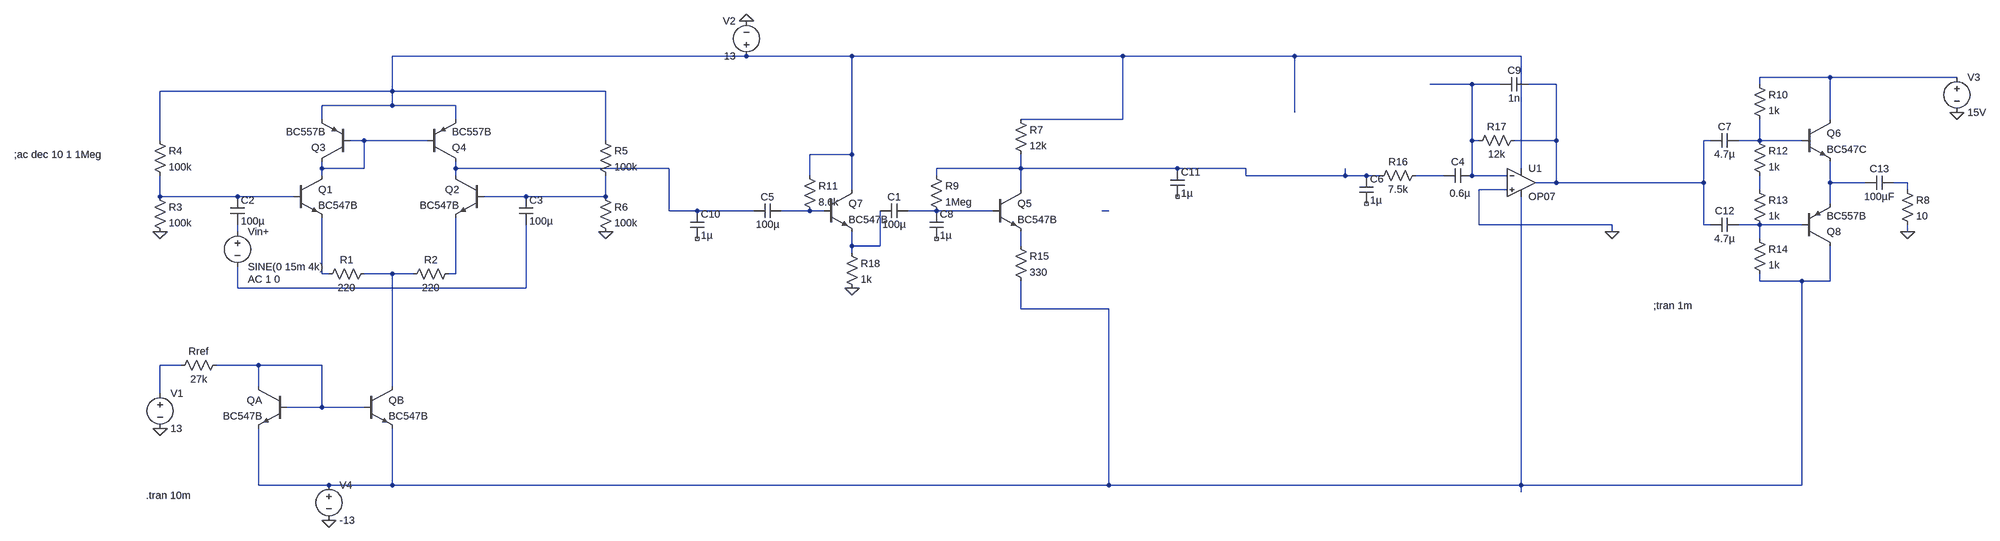
[diagram p0: schematic Complete_ckt.asc]
Complete_ckt.asc, the LTspice schematic file:
Version 4
SHEET 1 4536 1044
WIRE 1072 -192 160 -192
WIRE 1312 -192 1072 -192
WIRE 1936 -192 1312 -192
WIRE 2928 -192 1936 -192
WIRE 3472 -192 2928 -192
WIRE 4176 -144 4016 -144
WIRE 4464 -144 4176 -144
WIRE 3360 -128 3264 -128
WIRE 3424 -128 3360 -128
WIRE 3552 -128 3488 -128
WIRE 4016 -128 4016 -144
WIRE 160 -112 160 -192
WIRE 160 -112 -368 -112
WIRE 752 -112 160 -112
WIRE 160 -80 160 -112
WIRE 160 -80 0 -80
WIRE 304 -80 160 -80
WIRE 2928 -64 2928 -192
WIRE 0 -48 0 -80
WIRE 304 -48 304 -80
WIRE 1936 -48 1936 -192
WIRE 1936 -48 1696 -48
WIRE 4176 -48 4176 -144
WIRE -368 0 -368 -112
WIRE 96 0 64 0
WIRE 240 0 96 0
WIRE 752 0 752 -112
WIRE 3360 0 3360 -128
WIRE 3376 0 3360 0
WIRE 3552 0 3552 -128
WIRE 3552 0 3456 0
WIRE 3904 0 3888 0
WIRE 4016 0 4016 -48
WIRE 4016 0 3968 0
WIRE 4112 0 4016 0
WIRE 1312 32 1312 -192
WIRE 1312 32 1216 32
WIRE 0 64 0 48
WIRE 96 64 96 0
WIRE 96 64 0 64
WIRE 304 64 304 48
WIRE 896 64 304 64
WIRE 1696 64 1696 32
WIRE 1696 64 1504 64
WIRE 2112 64 1696 64
WIRE 2784 64 2112 64
WIRE 3472 64 3472 -192
WIRE 0 80 0 64
WIRE 304 80 304 64
WIRE 1216 80 1216 32
WIRE 1504 80 1504 64
WIRE 2784 80 2784 64
WIRE 3072 80 3072 64
WIRE 3072 80 2784 80
WIRE 3120 80 3072 80
WIRE 3152 80 3120 80
WIRE 3296 80 3232 80
WIRE 3360 80 3360 0
WIRE 3440 80 3360 80
WIRE 3552 96 3552 0
WIRE 3552 96 3504 96
WIRE 3888 96 3888 0
WIRE 3888 96 3552 96
WIRE 4176 96 4176 48
WIRE 4256 96 4176 96
WIRE 4352 96 4320 96
WIRE 1312 112 1312 32
WIRE 1696 112 1696 64
WIRE 3440 112 3376 112
WIRE 4016 112 4016 80
WIRE 4352 112 4352 96
WIRE -368 128 -368 80
WIRE -192 128 -368 128
WIRE -64 128 -192 128
WIRE 464 128 368 128
WIRE 752 128 752 80
WIRE 752 128 464 128
WIRE 4176 144 4176 96
WIRE 896 160 896 64
WIRE 960 160 896 160
WIRE 1088 160 960 160
WIRE 1216 160 1152 160
WIRE 1248 160 1216 160
WIRE 1504 160 1440 160
WIRE 1632 160 1504 160
WIRE 1904 160 1888 160
WIRE 3376 192 3376 112
WIRE 3680 192 3376 192
WIRE 3888 192 3888 96
WIRE 3904 192 3888 192
WIRE 4016 192 3968 192
WIRE 4112 192 4016 192
WIRE -192 208 -192 192
WIRE 3680 208 3680 192
WIRE 4352 208 4352 192
WIRE 4016 224 4016 192
WIRE 1312 240 1312 208
WIRE 1376 240 1376 160
WIRE 1376 240 1312 240
WIRE 1696 240 1696 208
WIRE 1312 256 1312 240
WIRE 0 304 0 176
WIRE 16 304 0 304
WIRE 160 304 96 304
WIRE 208 304 160 304
WIRE 304 304 304 176
WIRE 304 304 288 304
WIRE 4016 320 4016 304
WIRE 4112 320 4016 320
WIRE 4176 320 4176 240
WIRE 4176 320 4112 320
WIRE -192 336 -192 288
WIRE 464 336 464 192
WIRE 464 336 -192 336
WIRE 1696 384 1696 320
WIRE 1904 384 1696 384
WIRE -320 512 -368 512
WIRE -144 512 -240 512
WIRE 0 512 -144 512
WIRE -144 560 -144 512
WIRE 160 560 160 304
WIRE -368 576 -368 512
WIRE 0 608 0 512
WIRE 0 608 -80 608
WIRE 96 608 0 608
WIRE -144 880 -144 656
WIRE 16 880 -144 880
WIRE 160 880 160 656
WIRE 160 880 16 880
WIRE 1904 880 1904 384
WIRE 1904 880 160 880
WIRE 3472 880 3472 128
WIRE 3472 880 1904 880
WIRE 4112 880 4112 320
WIRE 4112 880 3472 880
WIRE 3472 896 3472 880
FLAG -368 656 0
FLAG -368 208 0
FLAG 752 208 0
FLAG 3680 208 0
FLAG 16 960 0
FLAG 1072 -272 0
FLAG 1312 336 0
FLAG 4352 208 0
FLAG 4464 -64 0
SYMBOL npn 368 80 M0
SYMATTR InstName Q2
SYMATTR Value BC547B
SYMBOL npn -64 80 R0
SYMATTR InstName Q1
SYMATTR Value BC547B
SYMBOL res 112 288 R90
WINDOW 0 0 56 VBottom 2
WINDOW 3 32 56 VTop 2
SYMATTR InstName R1
SYMATTR Value 220
SYMBOL res 304 288 R90
WINDOW 0 0 56 VBottom 2
WINDOW 3 32 56 VTop 2
SYMATTR InstName R2
SYMATTR Value 220
SYMBOL npn 96 560 R0
SYMATTR InstName QB
SYMATTR Value BC547B
SYMBOL npn -80 560 M0
SYMATTR InstName QA
SYMATTR Value BC547B
SYMBOL res -224 496 R90
WINDOW 0 0 56 VBottom 2
WINDOW 3 32 56 VTop 2
SYMATTR InstName Rref
SYMATTR Value 27k
SYMBOL voltage -192 192 R0
WINDOW 123 24 124 Left 2
WINDOW 39 0 0 Left 0
SYMATTR Value2 AC 1 0
SYMATTR InstName Vin+
SYMATTR Value SINE(0 15m 4k)
SYMBOL voltage -368 560 R0
WINDOW 123 0 0 Left 0
WINDOW 39 0 0 Left 0
SYMATTR InstName V1
SYMATTR Value 13
SYMBOL cap -208 128 R0
SYMATTR InstName C2
SYMATTR Value 100µ
SYMBOL res -384 112 R0
SYMATTR InstName R3
SYMATTR Value 100k
SYMBOL res -384 -16 R0
SYMATTR InstName R4
SYMATTR Value 100k
SYMBOL res 736 -16 R0
SYMATTR InstName R5
SYMATTR Value 100k
SYMBOL res 736 112 R0
SYMATTR InstName R6
SYMATTR Value 100k
SYMBOL npn 1632 112 R0
SYMATTR InstName Q5
SYMATTR Value BC547B
SYMBOL res 1680 -64 R0
SYMATTR InstName R7
SYMATTR Value 12k
SYMBOL cap 1440 144 R90
WINDOW 0 0 32 VBottom 2
WINDOW 3 32 32 VTop 2
SYMATTR InstName C1
SYMATTR Value 100µ
SYMBOL cap 1152 144 R90
WINDOW 0 0 32 VBottom 2
WINDOW 3 32 32 VTop 2
SYMATTR InstName C5
SYMATTR Value 100µ
SYMBOL res 1680 224 R0
SYMATTR InstName R15
SYMATTR Value 330
SYMBOL res 1488 64 R0
SYMATTR InstName R9
SYMATTR Value 1Meg
SYMBOL cap 448 128 R0
SYMATTR InstName C3
SYMATTR Value 100µ
SYMBOL cap 3360 64 R90
WINDOW 0 0 32 VBottom 2
WINDOW 3 41 27 VTop 2
SYMATTR InstName C4
SYMATTR Value 0.6µ
SYMBOL res 3248 64 R90
WINDOW 0 0 56 VBottom 2
WINDOW 3 32 56 VTop 2
SYMATTR InstName R16
SYMATTR Value 7.5k
SYMBOL OpAmps\\OP07 3472 32 R0
SYMATTR InstName U1
SYMBOL res 3472 -16 R90
WINDOW 0 0 56 VBottom 2
WINDOW 3 32 56 VTop 2
SYMATTR InstName R17
SYMATTR Value 12k
SYMBOL voltage 16 864 R0
WINDOW 123 0 0 Left 0
WINDOW 39 0 0 Left 0
SYMATTR InstName V4
SYMATTR Value -13
SYMBOL voltage 1072 -176 R180
WINDOW 0 24 96 Left 2
WINDOW 3 24 16 Left 2
WINDOW 123 0 0 Left 0
WINDOW 39 0 0 Left 0
SYMATTR InstName V2
SYMATTR Value 13
SYMBOL pnp 64 48 R180
SYMATTR InstName Q3
SYMATTR Value BC557B
SYMBOL pnp 240 48 M180
SYMATTR InstName Q4
SYMATTR Value BC557B
SYMBOL npn 1248 112 R0
SYMATTR InstName Q7
SYMATTR Value BC547B
SYMBOL res 1200 64 R0
SYMATTR InstName R11
SYMATTR Value 8.6k
SYMBOL res 1296 240 R0
SYMATTR InstName R18
SYMATTR Value 1k
SYMBOL cap 1488 160 R0
SYMATTR InstName C8
SYMATTR Value 1µ
SYMBOL cap 944 160 R0
SYMATTR InstName C10
SYMATTR Value 1µ
SYMBOL cap 3488 -144 R90
WINDOW 0 0 32 VBottom 2
WINDOW 3 32 32 VTop 2
SYMATTR InstName C9
SYMATTR Value 1n
SYMBOL cap 2096 64 R0
SYMATTR InstName C11
SYMATTR Value 1µ
SYMBOL cap 3104 80 R0
SYMATTR InstName C6
SYMATTR Value 1µ
SYMBOL npn 4112 -48 R0
SYMATTR InstName Q6
SYMATTR Value BC547C
SYMBOL pnp 4112 240 M180
SYMATTR InstName Q8
SYMATTR Value BC557B
SYMBOL cap 3968 -16 R90
WINDOW 0 0 32 VBottom 2
WINDOW 3 32 32 VTop 2
SYMATTR InstName C7
SYMATTR Value 4.7µ
SYMBOL cap 3968 176 R90
WINDOW 0 0 32 VBottom 2
WINDOW 3 32 32 VTop 2
SYMATTR InstName C12
SYMATTR Value 4.7µ
SYMBOL res 4336 96 R0
SYMATTR InstName R8
SYMATTR Value 10
SYMBOL res 4000 -144 R0
SYMATTR InstName R10
SYMATTR Value 1k
SYMBOL res 4000 -16 R0
SYMATTR InstName R12
SYMATTR Value 1k
SYMBOL res 4000 96 R0
SYMATTR InstName R13
SYMATTR Value 1k
SYMBOL res 4000 208 R0
SYMATTR InstName R14
SYMATTR Value 1k
SYMBOL voltage 4464 -160 R0
WINDOW 123 0 0 Left 0
WINDOW 39 0 0 Left 0
SYMATTR InstName V3
SYMATTR Value 15V
SYMBOL cap 4320 80 R90
WINDOW 0 0 32 VBottom 2
WINDOW 3 32 32 VTop 2
SYMATTR InstName C13
SYMATTR Value 100µF
TEXT -400 904 Left 2 !.tran 10m
TEXT -760 32 Left 2 !;ac dec 10 1 1Meg
TEXT 3774 376 Left 2 !;tran 1m

The netlist it stands for:
* Complete_ckt.asc
Q2 N007 N014 N024 0 BC547B
Q1 N005 N013 N022 0 BC547B
R1 N023 N022 220
R2 N024 N023 220
QB N023 N028 N025 0 BC547B
QA N028 N028 N025 0 BC547B
Rref N028 N027 27k
Vin+ N019 N026 SINE(0 15m 4k) AC 1 0
V1 N027 0 13
C2 N013 N019 100µ
R3 N013 0 100k
R4 N001 N013 100k
R5 N001 N014 100k
R6 N014 0 100k
Q5 N008 N016 N021 0 BC547B
R7 N001 N008 12k
C1 N016 N020 100µ
C5 N015 N007 100µ
R15 N021 N025 330
R9 N008 N016 1Meg
C3 N014 N026 100µ
C4 N003 N009 0.6µ
R16 N009 N008 7.5k
XU1 0 N003 N001 N025 N004 LT1001  ; OP07, pins In+ In- V+ V- OUT
R17 N004 N003 12k
V4 N025 0 -13
V2 N001 0 13
Q3 N005 N005 N001 0 BC557B
Q4 N007 N005 N001 0 BC557B
Q7 N001 N015 N020 0 BC547B
R11 N001 N015 8.6k
R18 N020 0 1k
C8 N016 NC_01 1µ
C10 N007 NC_02 1µ
C9 N004 N003 1n
C11 N008 NC_03 1µ
C6 N008 NC_04 1µ
Q6 N002 N006 N010 0 BC547C
Q8 N025 N018 N010 0 BC557B
C7 N006 N004 4.7µ
C12 N018 N004 4.7µ
R8 N011 0 10
R10 N002 N006 1k
R12 N006 N012 1k
R13 N012 N018 1k
R14 N018 N025 1k
V3 N002 0 15V
C13 N011 N010 100µF
.model NPN NPN
.model PNP PNP
.lib standard.bjt
.tran 10m
;ac dec 10 1 1Meg
;tran 1m
.lib LTC.lib
.backanno
.end